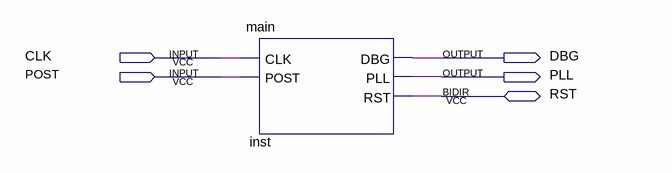
[diagram p0: schematic sheet]
// Quartus schematic FreeRunner.bdf as structural Verilog: 1 symbols, 5 pins
module FreeRunner (
  input  CLK,
  input  POST,
  inout  RST,
  output DBG,
  output PLL
);

  main inst (.CLK(CLK), .POST(POST), .DBG(DBG), .PLL(PLL), .RST(RST));
endmodule
